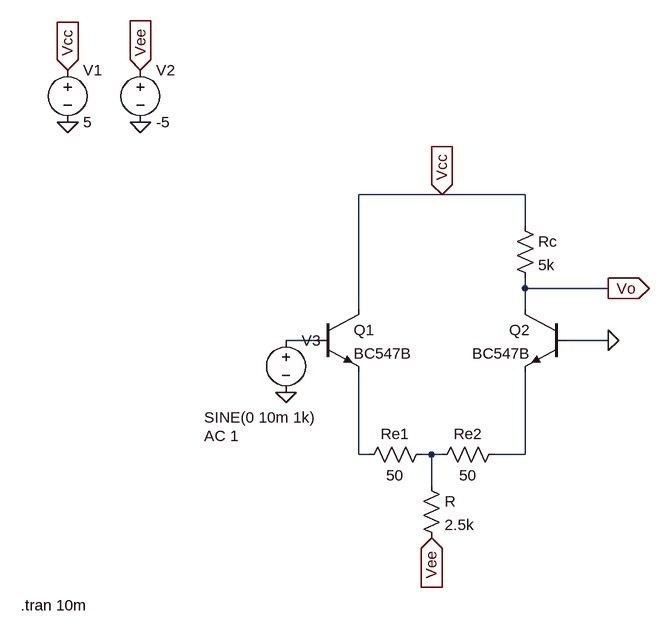
[diagram p0: schematic pre_amp.asc]
pre_amp.asc, the LTspice schematic file:
Version 4
SHEET 1 1384 728
WIRE 304 80 176 80
WIRE 432 80 304 80
WIRE 432 128 432 80
WIRE 432 224 432 208
WIRE 560 224 432 224
WIRE 176 256 176 80
WIRE 432 256 432 224
WIRE 112 304 64 304
WIRE 560 304 496 304
WIRE 176 480 176 352
WIRE 192 480 176 480
WIRE 288 480 272 480
WIRE 304 480 288 480
WIRE 432 480 432 352
WIRE 432 480 384 480
WIRE 288 528 288 480
FLAG -272 -32 0
FLAG -160 -32 0
FLAG -272 -112 Vcc
IOPIN -272 -112 In
FLAG -160 -112 Vee
IOPIN -160 -112 In
FLAG 288 608 Vee
IOPIN 288 608 In
FLAG 304 80 Vcc
IOPIN 304 80 In
FLAG 560 304 0
FLAG 64 384 0
FLAG 560 224 Vo
IOPIN 560 224 Out
DATAFLAG 448 224 ""
SYMBOL npn 112 256 R0
SYMATTR InstName Q1
SYMATTR Value BC547B
SYMBOL npn 496 256 M0
SYMATTR InstName Q2
SYMATTR Value BC547B
SYMBOL voltage -272 -128 R0
WINDOW 123 0 0 Left 0
WINDOW 39 0 0 Left 0
SYMATTR InstName V1
SYMATTR Value 5
SYMBOL voltage -160 -128 R0
WINDOW 123 0 0 Left 0
WINDOW 39 0 0 Left 0
SYMATTR InstName V2
SYMATTR Value -5
SYMBOL res 288 464 R90
WINDOW 0 0 56 VBottom 2
WINDOW 3 32 56 VTop 2
SYMATTR InstName Re1
SYMATTR Value 50
SYMBOL res 400 464 R90
WINDOW 0 0 56 VBottom 2
WINDOW 3 32 56 VTop 2
SYMATTR InstName Re2
SYMATTR Value 50
SYMBOL res 272 512 R0
SYMATTR InstName R
SYMATTR Value 2.5k
SYMBOL res 416 112 R0
SYMATTR InstName Rc
SYMATTR Value 5k
SYMBOL voltage 64 288 R0
WINDOW 3 -126 135 Left 2
WINDOW 123 -126 163 Left 2
WINDOW 39 0 0 Left 0
SYMATTR Value SINE(0 10m 1k)
SYMATTR Value2 AC 1
SYMATTR InstName V3
TEXT -344 712 Left 2 !.tran 10m

The netlist it stands for:
* pre_amp.asc
Q1 Vcc N001 N002 0 BC547B
Q2 Vo 0 N004 0 BC547B
V1 Vcc 0 5
V2 Vee 0 -5
Re1 N003 N002 50
Re2 N004 N003 50
R N003 Vee 2.5k
Rc Vcc Vo 5k
V3 N001 0 SINE(0 10m 1k) AC 1
.model NPN NPN
.model PNP PNP
.lib standard.bjt
.tran 10m
.backanno
.end